# EAGLE design psuboardBetter (EAGLE 9.5.1)
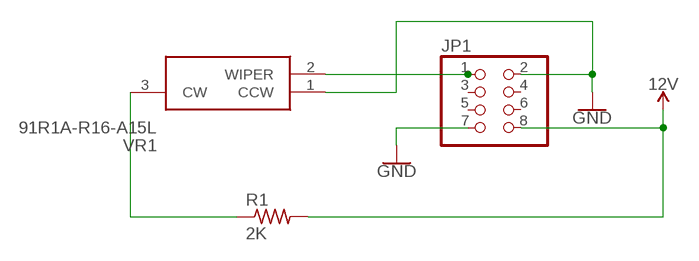
[diagram p0: schematic, sheet 1]

## Parts
JP1  PINHD-2X4  [2X04]
R1  2K  R-US_R0805  [R0805]
VR1  91R1A-R16-A15L  [91R1AR16A15L]

## Nets
12V: JP1.8 R1.2
GND: JP1.2 JP1.7 VR1.1(CCW)
N$3: R1.1 VR1.3(CW)
N$7: JP1.1 VR1.2(WIPER)
Unconnected: JP1.3 JP1.4 JP1.5 JP1.6

## Library data of the parts
JP1 = adafruit:PINHD-2X4: PIN HEADER
R1 = resistor:R-US_: RESISTOR, American symbol
VR1 = SamacSys_Parts:91R1A-R16-A15L: Potentiometers 10K 10% 5/8" SQ ST Source: Datasheet <https://componentsearchengine.com/Datasheets/1/91R1A-R16-A15L.pdf>; DESCRIPTION: Potentiometers 10K 10% 5/8" SQ ST; HEIGHT: 17.45mm; MANUFACTURER_NAME: Bourns; MANUFACTURER_PART_NUMBER: 91R1A-R16-A15L; MOUSER_PART_NUMBER: 652-91R1A-R16-A15L; MOUSER_PRICE-STOCK: https://www.mouser.com/Search/Refine.aspx?Keyword=652-91R1A-R16-A15L

## Board
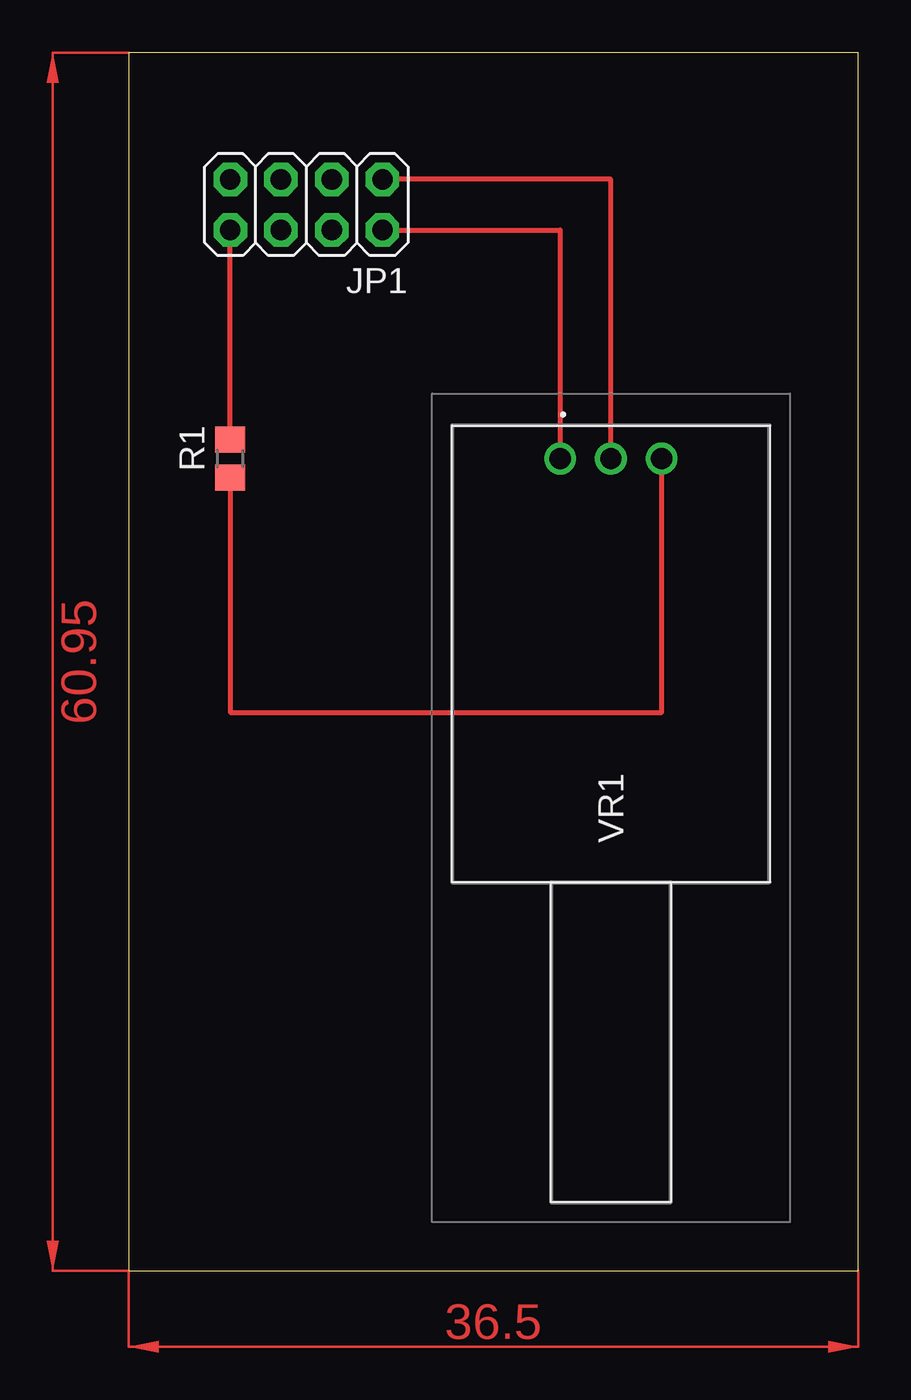
[diagram p1: board, top side]
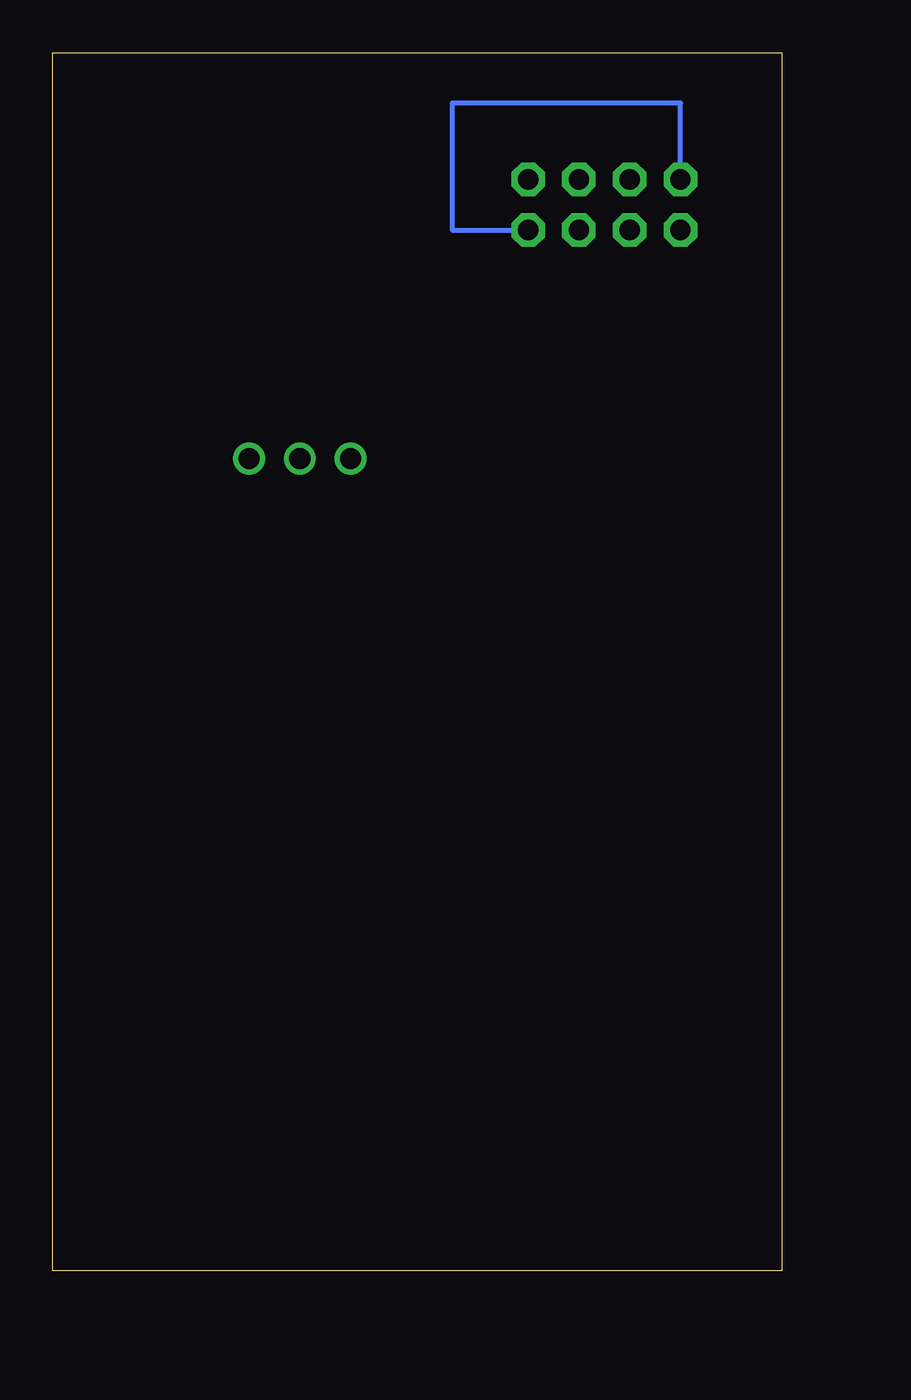
[diagram p2: board, bottom side, seen from below]

Size 36.5 x 60.95 mm. Coordinates in mm from the lower left corner, seen from the top.
Outline: 0,0 36.5,0 36.5,60.95 0,60.95 0,0
Copper layers (1*16): Top 0.035mm / dielectric 1.5mm / Bottom 0.035mm
Design rules "default": minimum track width 6mil, minimum drill 0.35mm, track to track 6mil, track to pad 6mil, pad to pad 6mil, via to via 6mil, smd to smd 6mil, copper to edge 40mil, drill to drill 6mil, minimum pad ring 10mil, minimum via ring 8mil, stop-mask expansion 4mil, vias tented up to drill 0mil, thermal gap 10mil

### Footprints (pad centres in the part's own frame; a part is rotated, then mirrored left to right if it is on the bottom)
2X04 = drill 1.016 pad 1.676 octagon: 1 -3.81,-1.27; 2 -3.81,1.27; 3 -1.27,-1.27; 4 -1.27,1.27; 5 1.27,-1.27; 6 1.27,1.27; 7 3.81,-1.27; 8 3.81,1.27
R0805 = smd 1.3 x 1.5: 1 -0.95,0; 2 0.95,0
91R1AR16A15L = drill 1.06 pad 1.59: 1 0,0; 2 0,2.54; 3 0,5.08

### Placement (x,y rotation side)
JP1  8.89,53.34 180 top
R1  5.08,40.64 90 top
VR1  21.59,40.64 270 top

### Tracks (layer width: path | path; a pad name or v marks a point on that pad's centre or on a via)
12V
  Top 0.254: R1.2 JP1.8
GND
  Top 0.254: JP1.2 21.59,52.07 VR1.1
  Bottom 0.254: JP1.7 5.08,58.42 16.51,58.42 16.51,52.07 JP1.2
N$3
  Top 0.254: R1.1 5.08,27.94 26.67,27.94 VR1.3
N$7
  Top 0.254: VR1.2 24.13,54.61 JP1.1
(copper drawn outside any net)
  shapes: Top area x2